# EAGLE schematic MOD-v2-1_MOD-Actuators (EAGLE 8.2.2)
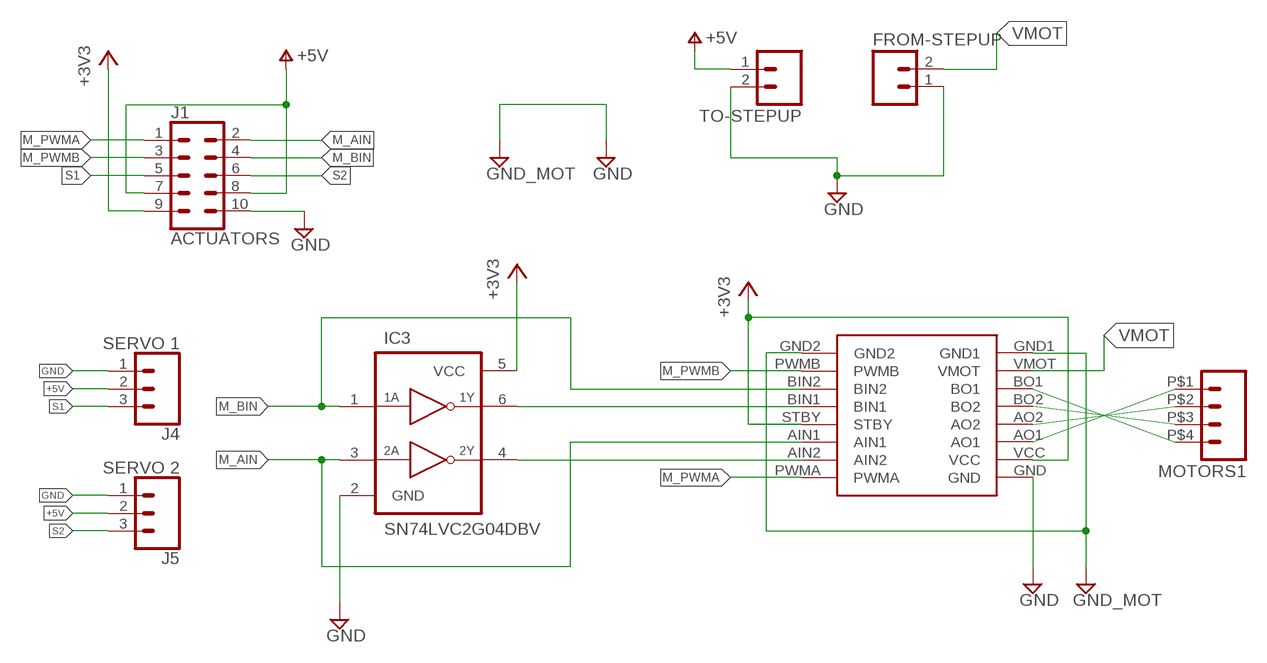
[diagram p0: schematic, sheet 1]

## Parts
FROM-STEPUP  M02LOCK  [1X02_LOCK]
IC3  SN74LVC2G04DBV  [SOT23-6]
J1  ACTUATORS  CONN_05X2SHD_LOCK  [2X5-SHROUDED_LOCK]
J4  SERVO 1  CONN_03LOCK  [1X03_LOCK@1]
J5  SERVO 2  CONN_03LOCK  [1X03_LOCK@1]
MOTORS1  M04  [SPRINGTERMINAL-2.54MM-4]
TO-STEPUP  M02LOCK  [1X02_LOCK]
U$7  POLOLU_TB6612FNG  [POLOLU_TB6612FNG]

## Nets
+3V3: IC3.5(VCC) J1.9 U$7.STBY U$7.VCC
+5V [Power]: J1.7 J1.8 J4.2 J5.2 TO-STEPUP.1 ; supply symbol labelled V+
GND [Power]: FROM-STEPUP.1 IC3.2(GND) J1.10 J4.1 J5.1 TO-STEPUP.2 U$7.GND ; supply symbol labelled GND_MOT
GND_MOT [Power]: U$7.GND1 U$7.GND2
M_AIN: IC3.3(2A) J1.2 U$7.AIN1
M_BIN: IC3.1(1A) J1.4 U$7.BIN2
M_PWMA: J1.1 U$7.PWMA
M_PWMB: J1.3 U$7.PWMB
N$1 [Power]: MOTORS1.P$1 U$7.AO1
N$2 [Power]: MOTORS1.P$2 U$7.AO2
N$3 [Power]: MOTORS1.P$3 U$7.BO2
N$4 [Power]: MOTORS1.P$4 U$7.BO1
N$5: IC3.6(1Y) U$7.BIN1
N$6: IC3.4(2Y) U$7.AIN2
S1: J1.5 J4.3
S2: J1.6 J5.3
VMOT [Power]: FROM-STEPUP.2 U$7.VMOT

## Library data of the parts
FROM-STEPUP TO-STEPUP = CMU-ArtFab:M02: Header 2 Standard 2-pin 0.1" header. Use with straight break away headers (SKU : PRT-00116), right angle break away headers (PRT-00553), swiss pins (PRT-00743), machine pins (PRT-00117), and female headers (PRT-00115). Molex polarized connector foot print use with SKU : PRT-08233 with associated crimp pins and housings.
IC3 = 74LV:SN74LVC2G04: DUAL INVERTER GATE
J1 = SparkFun-Connectors:CONN_05X2: Multi connection point. Often used as Generic Header-pin footprint for 0.1 inch spaced/style header connections For AVR SPI programming port, see special device with nice symbol: "AVR_SPI_PROG_5x2.dev" You can populate with any combo of single row headers, but if you'd like an exact match, check these: 2x5 AVR ICSP Male Header <https://www.sparkfun.com/products/778> (PRT-00778) 2x5 Pin Shrouded Header <https://www.sparkfun.com/products/8506> (PRT-08506) On any of the 0.1 inch spaced packages, you can populate with these: Break Away Headers - Straight <https://www.sparkfun.com/products/116> (PRT-00116) Break Away Male Headers - Right Angle <https://www.sparkfun.com/products/553> (PRT-00553) Female Headers <https://www.sparkfun.com/products/115> (PRT-00115) Break Away Headers - Machine Pin <https://www.sparkfun.com/products/117> (PRT-00117) Break Away Female Headers - Swiss Machine Pin <https://www.sparkfun.com/products/743> (PRT-00743) Special note: the shrouded connector mates well with our 5x2 ribbon cables: 2x5 Pin IDC Ribbon Cable <https://www.sparkfun.com/products/8535> (PRT-08535); PROD_ID: CONN-08671; SF_ID: PRT-08506
J4 J5 = SparkFun-Connectors:CONN_03: Multi connection point. Often used as Generic Header-pin footprint for 0.1 inch spaced/style header connections On any of the 0.1 inch spaced packages, you can populate with these: Break Away Headers - Straight <https://www.sparkfun.com/products/116> (PRT-00116) Break Away Male Headers - Right Angle <https://www.sparkfun.com/products/553> (PRT-00553) Female Headers <https://www.sparkfun.com/products/115> (PRT-00115) Break Away Headers - Machine Pin <https://www.sparkfun.com/products/117> (PRT-00117) Break Away Female Headers - Swiss Machine Pin <https://www.sparkfun.com/products/743> (PRT-00743) Stackable Header - 3 Pin (Female, 0.1") <https://www.sparkfun.com/products/13875> (PRT-13875) For SCREWTERMINALS and SPRING TERMINALS visit here: Screw Terimnals on SparkFun.com <https://www.sparkfun.com/search/results?term=Screw+Terminals> (5mm/3.5mm/2.54mm spacing) This device is also useful as a general connection point to wire up your design to another part of your project. Our various solder wires solder well into these plated through hole pads. Hook-Up Wire - Assortment (Stranded, 22 AWG) <https://www.sparkfun.com/products/11375> (PRT-11375) Hook-Up Wire - Assortment (Solid Core, 22 AWG) <https://www.sparkfun.com/products/11367> (PRT-11367) View the entire wire category on our website here <https://www.sparkfun.com/categories/141> Special notes: Molex polarized connector foot print use with SKU : PRT-08232 with associated crimp pins and housings.
MOTORS1 = CMU-ArtFab:M04: Header 4 Standard 4-pin 0.1" header. Use with straight break away headers (SKU : PRT-00116), right angle break away headers (PRT-00553), swiss pins (PRT-00743), machine pins (PRT-00117), and female headers (PRT-00115). Molex polarized connector foot print use with SKU : PRT-08231 with associated crimp pins and housings. 1MM SMD Version SKU: PRT-10208
U$7 = CMU-ArtFab:POLOLU_TB6612FNG

## Net classes
2 Power: width 0.381 mm, clearance 0.279 mm